# EAGLE design IR distance interrupter (EAGLE 9.4.2)
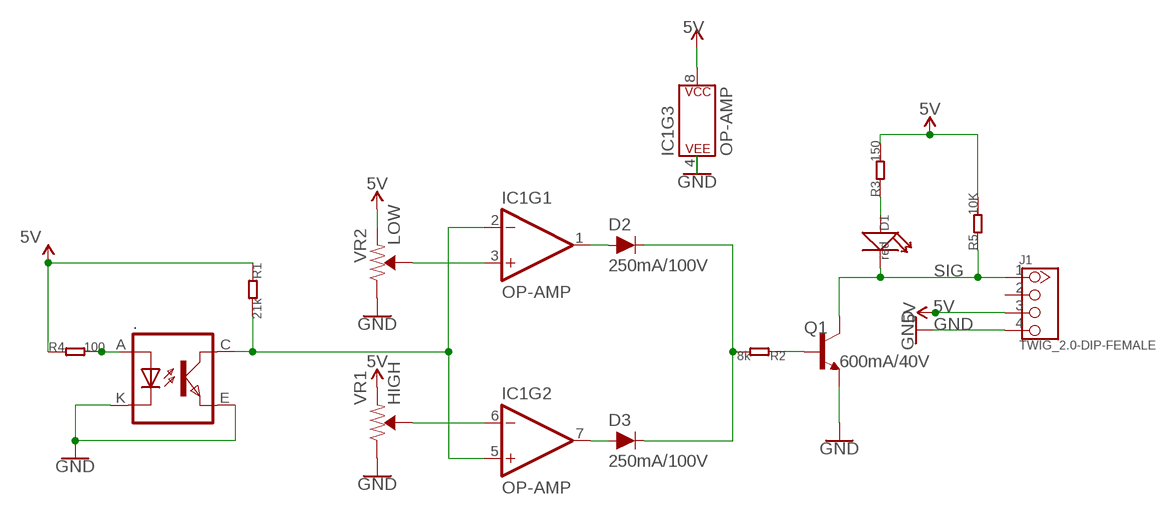
[diagram p0: schematic, sheet 1]

## Parts
.  TCRT5000  [TCRT5000]
D1  red  007-LED35*40  [LED0603]
D2  250mA/100V  DIODE-BAS16J  [SOD-323]
D3  250mA/100V  DIODE-BAS16J  [SOD-323]
IC1  OP-AMP  OPAMP-DUALU  [SO08]
J1  TWIG_2.0-DIP-FEMALE  [2.0_1X4]
Q1  600mA/40V  TRANS_NPN-MMBT2222AL  [SOT23-3]
R1  21k  005-R0603_S  [0603_S]
R2  8k  005-R0603_S  [0603_S]
R3  150  005-R0603_S  [0603_S]
R4  100  005-R0603_S  [0603_S]
R5  10K  005-R0603_S  [0603_S]
VR1  HIGH  TRIMPOT-SMD-5MM-CLOSED-1/4W-20%  [TRIMPOT-SMD-5MM]
VR2  LOW  TRIMPOT-SMD-5MM-CLOSED-1/4W-20%  [TRIMPOT-SMD-5MM]

## Nets
5V [5v]: IC1.8(P$V+) J1.3 R1.1 R3.2 R4.1 R5.2 VR1.A(CCW) VR2.A(CCW)
GND: ..E(EMITTER) ..K(CATHODE) IC1.4(P$V-) J1.4 Q1.2(E) VR1.C(CW) VR2.C(CW)
N$1: IC1.6(-IN) VR1.B(WIPER)
N$2: D1.1(+) R3.1
N$3: ..A(ANODE) R4.2
N$5: IC1.3(+IN) VR2.B(WIPER)
N$6: D2.A IC1.1(OUT)
N$7: D3.A IC1.7(OUT)
N$8: Q1.1(B) R2.1
N$9: D2.C D3.C R2.2
N$10: ..C(COLLECTOR) IC1.2(-IN) IC1.5(+IN) R1.2
SIG: D1.2(-) J1.1 Q1.3(C) R5.1
Unconnected: J1.2

## Library data of the parts
. = IAD-Library:TCRT5000: The Reflective Optical Sensor with Transistor Output TCRT5000.
D1 = Discrete:007-LED*
D2 D3 = SparkFun-DiscreteSemi:DIODE: Diode These are standard reverse protection diodes and small signal diodes. SparkFun Products: SparkFun SparkPunk Sound Kit <https://www.sparkfun.com/products/11177> SparkFun ESP8266 Thing <https://www.sparkfun.com/products/13231>; PROD_ID: DIO-09646
IC1 = SparkFun-IC-Amplifiers:OPAMP-DUAL: Generic op-amp footprint This component is for the standard 358 pinning of a dual op-amp From the LM358 datasheet: Pin 1: Output A Pin 2: Inverting Input A Pin 3: Non-Inverting Input A Pin 4: Gnd Pin 5: Non-Inverting Input B Pin 6: Inverting Input B Pin 7: Output B Pin 8: V+; PROD_ID: NA-XXXXX
J1 = Connector:TWIG_2.0-DIP-FEMALE
Q1 = SparkFun-DiscreteSemi:TRANS_NPN: NPN transistor Current controlled devices typically used to amplify current or used as a switch. BC547 - COM-08928 <http://www.sparkfun.com/products/8928> (TO-92 45V 100mA) (1.Collector 2.Base 3.Emitter) 2N3904 - COM-00521 <http://www.sparkfun.com/products/521> (TO-92 40V 200mA) (1.Emitter 2.Base 3.Collector) P2N2222A - COM-12852 <http://www.sparkfun.com/products/12852> (TO-92 40V 600mA) (1.Collector 2.Base 3.Emitter); PROD_ID: TRANS-08049
R1-R5 = Discrete:005-R*
VR1 VR2 = SparkFun-Resistors:TRIMPOT: Trimming Potentiometer (Trimpot) Three-terminal potentiometers, with an adjustable wiper and two adjustable resistors. A pot can be used to create a configurable voltage divider, or as a variable resistor. "Trimpots" are a subset of potentiometers, usually intended for "set-and-forget" applications. They're often more delicate than standard potentiometers - rated for fewer turns. Variants PTH-KNOB - PTH Trimpot w/ finger-adjustable knob Trimpot 10K with Knob <https://www.sparkfun.com/products/9806> (COM-09806) Datasheet <http://www.sparkfun.com/datasheets/Components/General/TSR-3386.pdf> SMD-3MM-CLOSED-FRAME - SMD 3mm Square Closed-Frame Trimpot Used on e.g. EasyDriver - Stepper Motor Driver <https://www.sparkfun.com/products/12779> Datasheet <http://www.bitechnologies.com/pdfs/22.pdf> (22AR10KTR) SMD-5MM - SMD 5mm Square Closed-Frame Trimpot Used on e.g. IOIO-OTG - V2.2 <https://www.sparkfun.com/products/13613> Datasheet <http://www.vishay.com/docs/51008/ts53.pdf> (TS53YL502MR10) SMD-3MM-1/10W-25% - 3mm Square Open-Frame Trimpot Used on e.g. SparkFun Shapeoko <https://www.sparkfun.com/products/13899> Datasheet <http://www.bourns.com/docs/Product-Datasheets/TC33.pdf> (TC33X-2-103E); PROD_ID: RES-11156; VALUE: 5k

## Net classes
0 default: width 0.4 mm, clearance 0.2 mm
1 5v: width 0.6 mm, clearance 0.2 mm

## Board
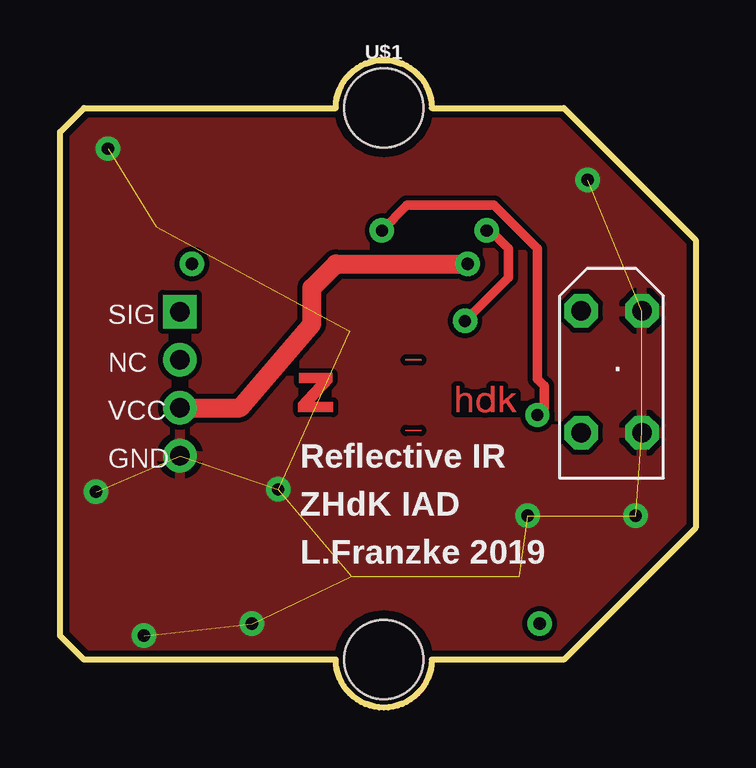
[diagram p1: board, top side]
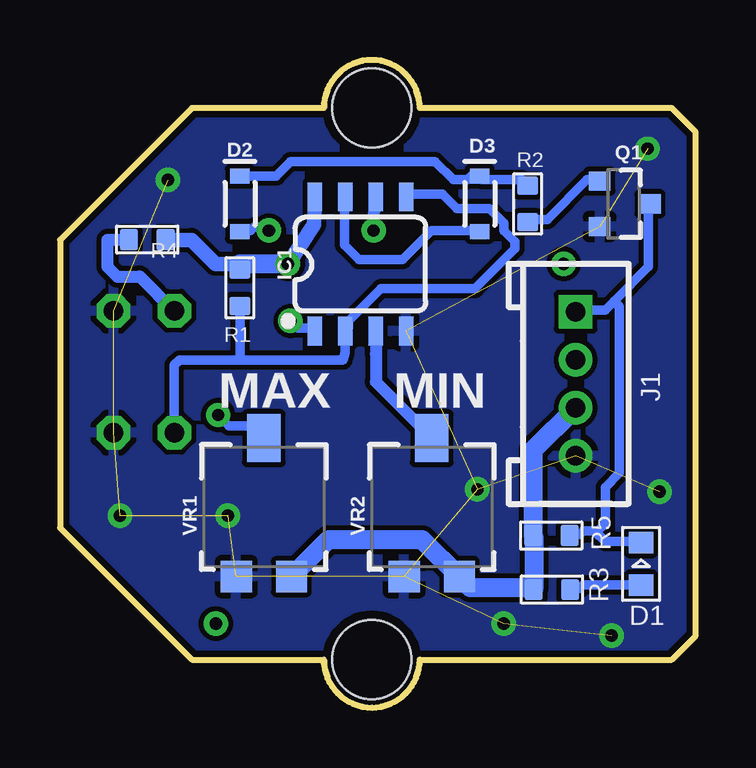
[diagram p2: board, bottom side, seen from below]

Size 26.5 x 27 mm. Coordinates in mm from the lower left corner, seen from the top.
Outline: 11.5,2 1,2 0,3 0,24 1,25 11.5,25 arc-180 15.5,25 21,25 26.5,19.5 26.5,7.5 21,2 15.5,2 arc-180 11.5,2
Copper layers (1*16): Top 0.035mm / dielectric 1.5mm / Bottom 0.035mm
Design rules "SparkFun": minimum track width 8mil, minimum drill 20mil, track to track 8mil, track to pad 8mil, pad to pad 8mil, via to via 8mil, smd to smd 8mil, copper to edge 10mil, drill to drill 8mil, minimum pad ring 12mil, minimum via ring 10mil, stop-mask expansion 4mil, vias tented up to drill 25mil, thermal gap 10mil

### Footprints (pad centres in the part's own frame; a part is rotated, then mirrored left to right if it is on the bottom)
TCRT5000 = drill 0.8 octagon: A -1.27,2.54; C -1.27,-2.54; E 1.27,-2.54; K 1.27,2.54
LED0603 = smd 0.889 x 1.016: 1 -0.889,0; 2 0.889,0
SOD-323 = smd 0.63 x 0.83: A 1.15,0; C -1.15,0
SO08 = smd 0.6 x 1.2: 1 -1.905,-2.8; 2 -0.635,-2.8; 3 0.635,-2.8; 4 1.905,-2.8; 5 1.905,2.8; 6 0.635,2.8; 7 -0.635,2.8; 8 -1.905,2.8
2.0_1X4 = drill 0.8 pad 1.27 square: 1 -3,0 | drill 0.8 pad 1.27: 2 -1,0; 3 1,0; 4 3,0
SOT23-3 = smd 0.8 x 0.9: 1 -0.95,-1; 2 0.95,-1; 3 0,1.1
0603_S = smd 0.762 x 0.889: 1 -0.762,0; 2 0.762,0
STAND-OFF = hole 3.302: 0,0
TRIMPOT-SMD-5MM = smd 1.3 x 1.3: A 1.15,-2.54; C -1.15,-2.54 | smd 1.402 x 2: B 0,3.239

### Placement (x,y rotation side)
.  23,14 0 top
D1  2.27,5.99 90 bottom
D2  19,21 270 bottom
D3  9,21 270 bottom
IC1  13.97,18.49 0 bottom
J1  5,13.5 270 bottom
Q1  3,21 270 bottom
R1  19,17.5 270 bottom
R2  7,21 90 bottom
R3  5.99,4.92 180 bottom
R4  22.86,19.51 180 bottom
R5  6.01,7.17 180 bottom
U$1  [STAND-OFF]  13.5,25 0 top
U$2  [ZHDK_LOGO]  9.2,14.5 0 top
U$3  [STAND-OFF]  13.5,2 0 top
VR1  18,8 0 bottom
VR2  11,8 0 bottom

### Tracks (layer width: path | path; a pad name or v marks a point on that pad's centre or on a via)
5V  (via drill 0.51)
  Top 0.8: J1.3 7.5,12.5 10.5,16 10.5,17.5 11.5,18.5 v17,18.5
  Bottom 0.6: IC1.8 15.9,20.14 v17,18.5 | 19,18.5 20.02,18.5 21.02,19.5 22.09,19.5 R4.1
  Bottom 0.8: 6.75,5 R3.2 | J1.3 6.78,10.72 R5.2 6.75,7.15 6.75,5 | 6.75,5 9.39,5 VR2.A 11.4,7.01 15.3,7.01 VR1.A | v17,18.5 19,18.5 R1.1
GND  (via drill 0.51)  (14 unrouted)
  other vias: 22,22 2,23.3 24,8 19.5,8 9.1,9.1 3.5,3 8,3.5 1.5,9
  pour Top (isolate 0.1): -2.81,26.64 27.78,26.64 27.78,-0.31 -2.81,-0.31
  pour Bottom (isolate 0.1): -1.81,25.64 26.59,25.64 26.59,-0.31 -1.81,-0.31
N$1  (via drill 0.51)
  Top 0.4: v13.42,19.89 14.48,20.95 18.1,20.95 19.91,19.14 19.91,13.71 20.21,13.4 20.21,12.5 v19.91,12.2
  Bottom 0.4: v19.91,12.2 19.45,11.75 18.55,11.75 18.1,11.29 VR1.B | v13.42,19.89 13.5,20
  Bottom 0.508: IC1.6 13.5,20
N$2
  Bottom 0.4: R3.1 5.13,4.96 4.83,4.96 4.67,5.11 2.41,5.11 D1.1
N$3
  Bottom 0.4: 24.51,19.49 24.49,19.51
  Bottom 0.508: ..A 23.14,17.95 | 23.14,17.95 23.18,17.99 | 23.14,17.95 24.1,17.95 24.51,18.37 24.51,19.49 24.52,19.5 | 24.49,19.51 R4.2
  Bottom 0.8: ..A 21.71,16.57
N$5
  Bottom 0.508: IC1.3 13.33,14.74 13.33,13.58 VR2.B
N$6  (via drill 0.51)
  Top 0.4: v17.79,19.89 17.95,19.89 18.7,19.14 18.7,17.93 v16.89,16.12
  Bottom 0.4: v17.79,19.89 17.95,20.04 18.4,20.04 18.55,19.89 18.85,19.89 D2.A | v16.89,16.12 16.59,15.82 15.98,15.82 IC1.1
N$7
  Bottom 0.4: IC1.7 14.63,21.27 14.63,19.29 14.02,18.68 12.21,18.68 11.01,19.89 9.05,19.89 D3.A
N$8
  Bottom 0.4: R2.1 6.94,20.34 6.18,20.34 4.52,22 4.07,22 Q1.1
N$9
  Bottom 0.4: R2.2 7.24,22 8.9,22 8.9,22.15 D3.C 9.2,22.15 9.35,22.15 9.5,22 10.1,22 10.86,22.75 16.89,22.75 17.49,22.15 18.85,22.15 D2.C
N$10
  Bottom 0.4: 14.63,15.67 IC1.2 | IC1.5 12.06,21.4 10.56,21.4 9.95,20.79 8.6,20.79 7.99,20.19 7.99,19.89 7.54,19.44 7.54,19.14 9.2,17.48 13.12,17.48 14.48,16.12 14.48,15.82 IC1.2 | 19,14.5 14.7,14.5 14.61,14.79 IC1.2 | R1.2 19,14.5 | ..C 21.73,14.29 21.52,14.5 19,14.5
N$15  (via drill 0.51)
  other vias: 20,3.5
N$19  (via drill 0.51)
  other vias: 5.5,18.5
SIG
  Bottom 0.4: 4.22,7.37 4.67,7.37 4.83,7.22 5.13,7.22 R5.1 | 4.22,7.37 3.77,6.92 2.41,6.92 D1.2 | 3.39,16.95 3.77,16.57 4.98,16.57 J1.1 | 3.39,16.95 1.96,18.38 1.96,20.95 Q1.3 | 3.39,16.95 3.17,16.72 3.17,9.79 3.77,9.18 3.77,7.67 4.07,7.37 4.22,7.37

### Text on the board
tPlace: SIG | NC | VCC | GND | Reflective IR | ZHdK IAD | L.Franzke 2019
bPlace: MIN | MAX